# Altium schematic sheet UVB LED Controller - current balancing.SchDoc: UVB LED Current Balancing
size A3; Author: Peake J; CompanyName: Scion Research; DrawnBy: Peake J; Engineer: Peake J; Organization: Scion; Address1: 49 Sala St; Address2: Whakarewarewa; Address3: Rotorua; Address4: New Zealand 3010; DocumentNumber: NA; Revision: 0; SheetNumber: 2; SheetTotal: 2
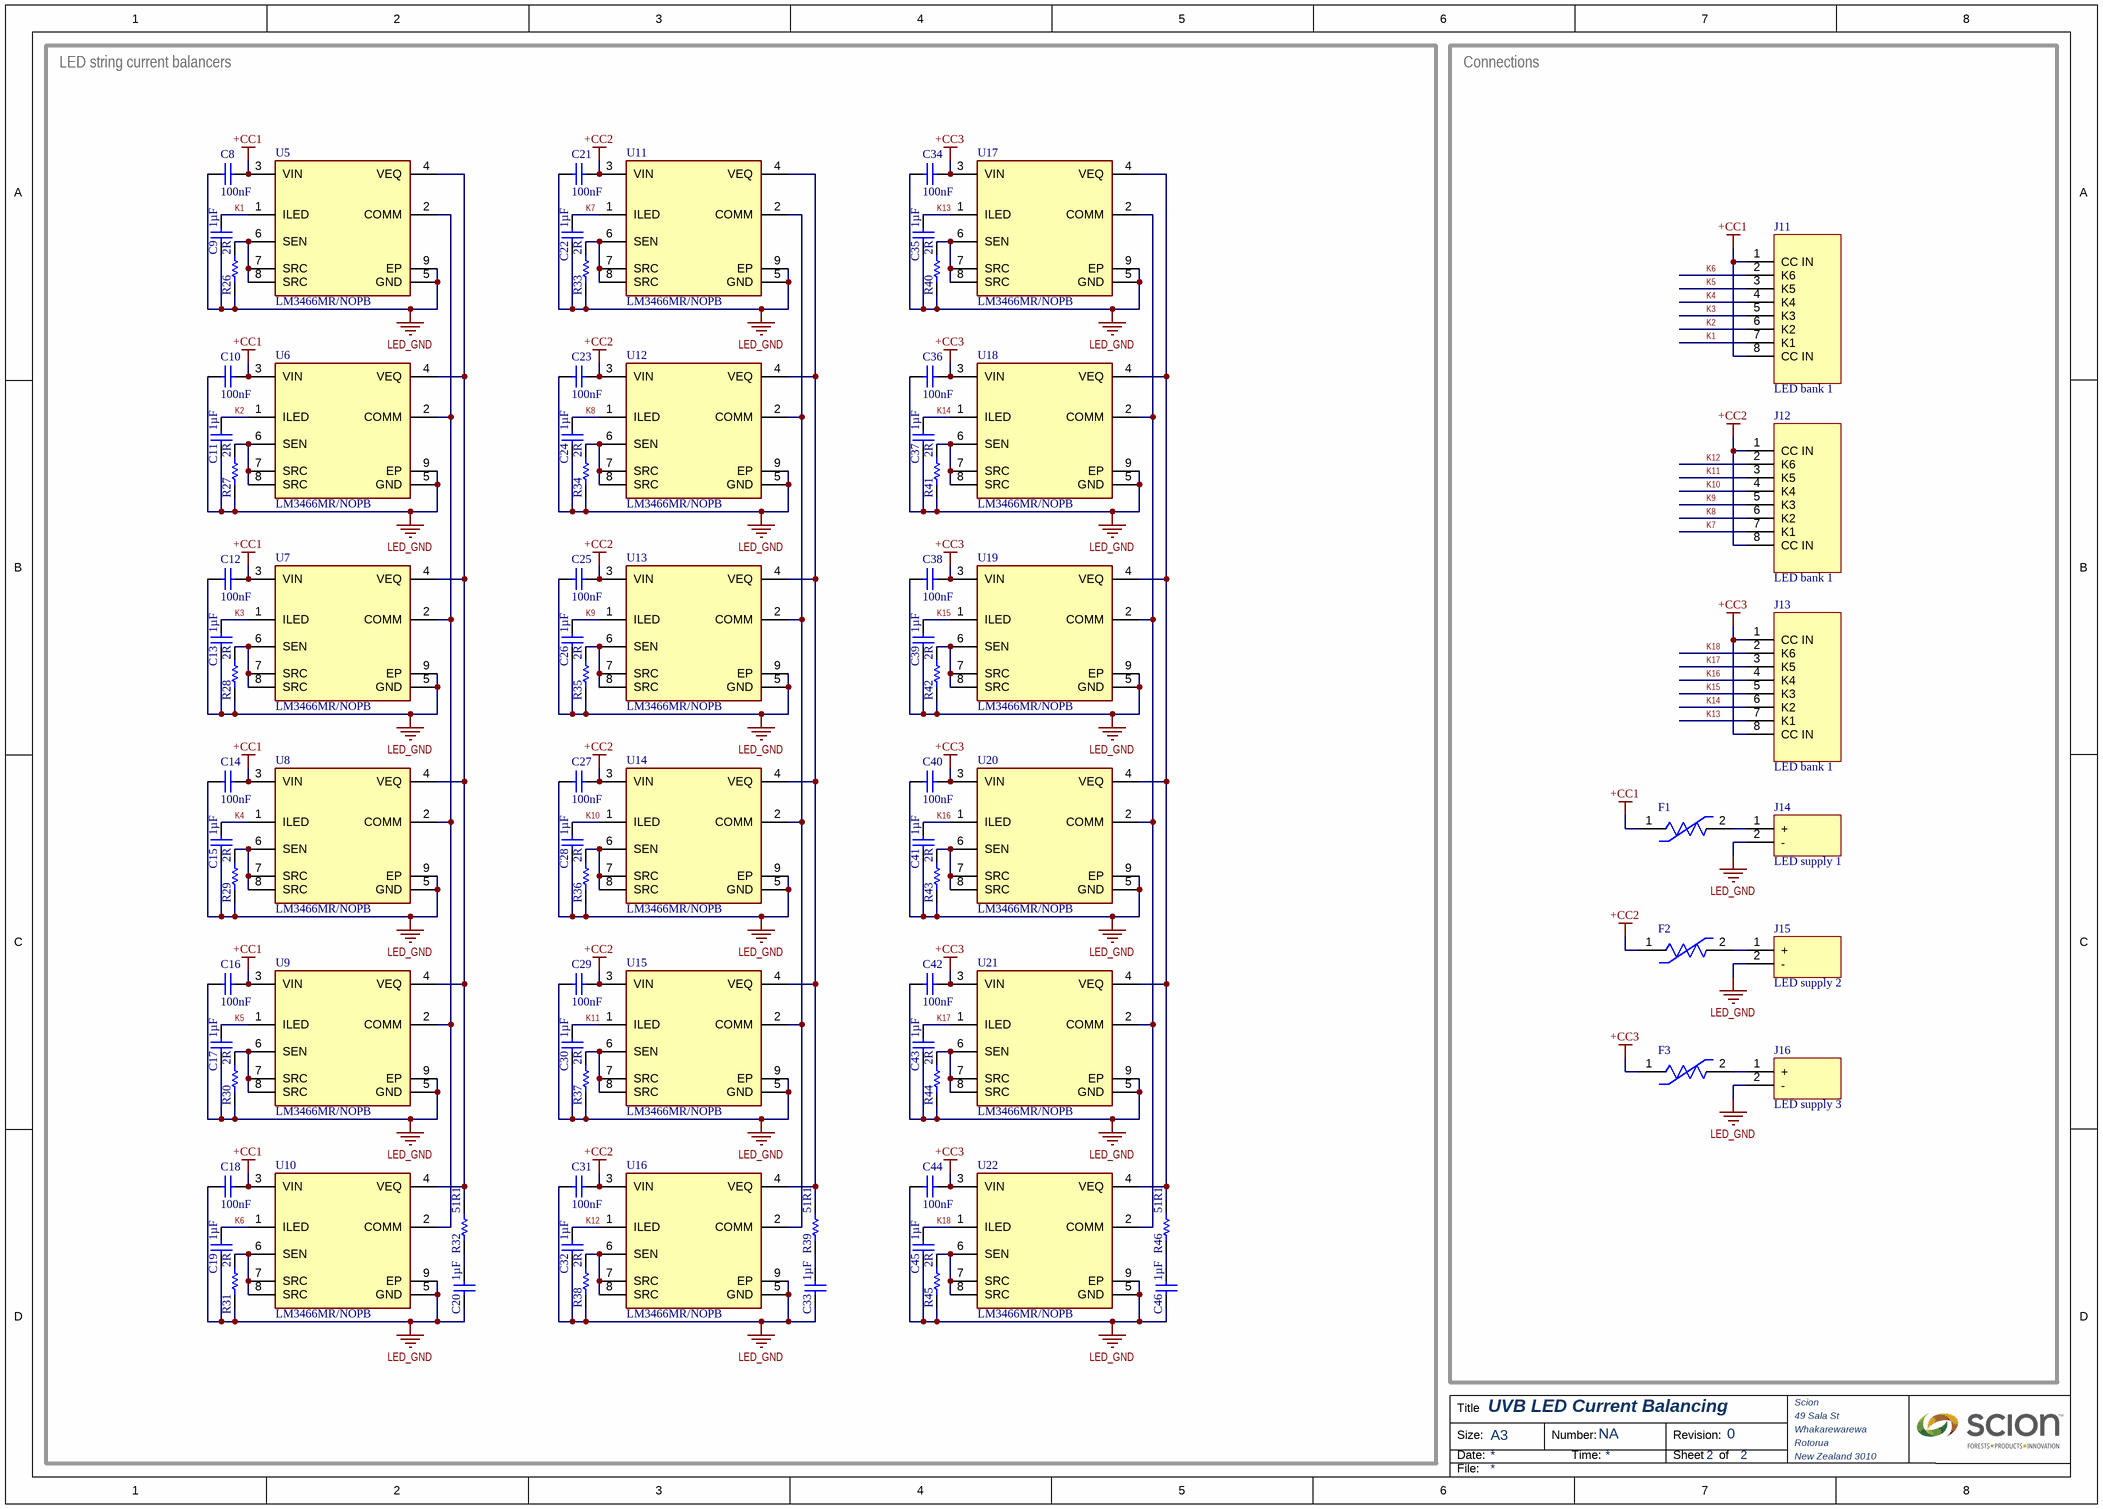
[diagram p0: UVB LED Controller - current balancing.SchDoc]

## Parts
C8  value 100nF  [0603_CAP]  (hidden comment: Capacitor)
C9  value 1µF  [0603_CAP]  (hidden comment: Capacitor)
C10  value 100nF  [0603_CAP]  (hidden comment: Capacitor)
C11  value 1µF  [0603_CAP]  (hidden comment: Capacitor)
C12  value 100nF  [0603_CAP]  (hidden comment: Capacitor)
C13  value 1µF  [0603_CAP]  (hidden comment: Capacitor)
C14  value 100nF  [0603_CAP]  (hidden comment: Capacitor)
C15  value 1µF  [0603_CAP]  (hidden comment: Capacitor)
C16  value 100nF  [0603_CAP]  (hidden comment: Capacitor)
C17  value 1µF  [0603_CAP]  (hidden comment: Capacitor)
C18  value 100nF  [0603_CAP]  (hidden comment: Capacitor)
C19  value 1µF  [0603_CAP]  (hidden comment: Capacitor)
C20  value 1µF  [0603_CAP]  (hidden comment: Capacitor)
C21  value 100nF  [0603_CAP]  (hidden comment: Capacitor)
C22  value 1µF  [0603_CAP]  (hidden comment: Capacitor)
C23  value 100nF  [0603_CAP]  (hidden comment: Capacitor)
C24  value 1µF  [0603_CAP]  (hidden comment: Capacitor)
C25  value 100nF  [0603_CAP]  (hidden comment: Capacitor)
C26  value 1µF  [0603_CAP]  (hidden comment: Capacitor)
C27  value 100nF  [0603_CAP]  (hidden comment: Capacitor)
C28  value 1µF  [0603_CAP]  (hidden comment: Capacitor)
C29  value 100nF  [0603_CAP]  (hidden comment: Capacitor)
C30  value 1µF  [0603_CAP]  (hidden comment: Capacitor)
C31  value 100nF  [0603_CAP]  (hidden comment: Capacitor)
C32  value 1µF  [0603_CAP]  (hidden comment: Capacitor)
C33  value 1µF  [0603_CAP]  (hidden comment: Capacitor)
C34  value 100nF  [0603_CAP]  (hidden comment: Capacitor)
C35  value 1µF  [0603_CAP]  (hidden comment: Capacitor)
C36  value 100nF  [0603_CAP]  (hidden comment: Capacitor)
C37  value 1µF  [0603_CAP]  (hidden comment: Capacitor)
C38  value 100nF  [0603_CAP]  (hidden comment: Capacitor)
C39  value 1µF  [0603_CAP]  (hidden comment: Capacitor)
C40  value 100nF  [0603_CAP]  (hidden comment: Capacitor)
C41  value 1µF  [0603_CAP]  (hidden comment: Capacitor)
C42  value 100nF  [0603_CAP]  (hidden comment: Capacitor)
C43  value 1µF  [0603_CAP]  (hidden comment: Capacitor)
C44  value 100nF  [0603_CAP]  (hidden comment: Capacitor)
C45  value 1µF  [0603_CAP]  (hidden comment: Capacitor)
C46  value 1µF  [0603_CAP]  (hidden comment: Capacitor)
F1  0ZCF0100AF2A  [FP-0ZCF0100AF2A-MFG]  (value not drawn)
F2  0ZCF0100AF2A  [FP-0ZCF0100AF2A-MFG]  (value not drawn)
F3  0ZCF0100AF2A  [FP-0ZCF0100AF2A-MFG]  (value not drawn)
J11  LED bank 1  [8P RA MOLEX Clik-MATE 1.5mm]
J12  LED bank 1  [8P RA MOLEX Clik-MATE 1.5mm]
J13  LED bank 1  [8P RA MOLEX Clik-MATE 1.5mm]
J14  LED supply 1  [2P 3.81mm Header Plugable]
J15  LED supply 2  [2P 3.81mm Header Plugable]
J16  LED supply 3  [2P 3.81mm Header Plugable]
R26  value 2R  [0603_RES]  (hidden comment: Resistor)
R27  value 2R  [0603_RES]  (hidden comment: Resistor)
R28  value 2R  [0603_RES]  (hidden comment: Resistor)
R29  value 2R  [0603_RES]  (hidden comment: Resistor)
R30  value 2R  [0603_RES]  (hidden comment: Resistor)
R31  value 2R  [0603_RES]  (hidden comment: Resistor)
R32  value 51R1  [0603_RES]  (hidden comment: Resistor)
R33  value 2R  [0603_RES]  (hidden comment: Resistor)
R34  value 2R  [0603_RES]  (hidden comment: Resistor)
R35  value 2R  [0603_RES]  (hidden comment: Resistor)
R36  value 2R  [0603_RES]  (hidden comment: Resistor)
R37  value 2R  [0603_RES]  (hidden comment: Resistor)
R38  value 2R  [0603_RES]  (hidden comment: Resistor)
R39  value 51R1  [0603_RES]  (hidden comment: Resistor)
R40  value 2R  [0603_RES]  (hidden comment: Resistor)
R41  value 2R  [0603_RES]  (hidden comment: Resistor)
R42  value 2R  [0603_RES]  (hidden comment: Resistor)
R43  value 2R  [0603_RES]  (hidden comment: Resistor)
R44  value 2R  [0603_RES]  (hidden comment: Resistor)
R45  value 2R  [0603_RES]  (hidden comment: Resistor)
R46  value 51R1  [0603_RES]  (hidden comment: Resistor)
U5  LM3466MR/NOPB  [FP-DDA0008A-MFG]
U6  LM3466MR/NOPB  [FP-DDA0008A-MFG]
U7  LM3466MR/NOPB  [FP-DDA0008A-MFG]
U8  LM3466MR/NOPB  [FP-DDA0008A-MFG]
U9  LM3466MR/NOPB  [FP-DDA0008A-MFG]
U10  LM3466MR/NOPB  [FP-DDA0008A-MFG]
U11  LM3466MR/NOPB  [FP-DDA0008A-MFG]
U12  LM3466MR/NOPB  [FP-DDA0008A-MFG]
U13  LM3466MR/NOPB  [FP-DDA0008A-MFG]
U14  LM3466MR/NOPB  [FP-DDA0008A-MFG]
U15  LM3466MR/NOPB  [FP-DDA0008A-MFG]
U16  LM3466MR/NOPB  [FP-DDA0008A-MFG]
U17  LM3466MR/NOPB  [FP-DDA0008A-MFG]
U18  LM3466MR/NOPB  [FP-DDA0008A-MFG]
U19  LM3466MR/NOPB  [FP-DDA0008A-MFG]
U20  LM3466MR/NOPB  [FP-DDA0008A-MFG]
U21  LM3466MR/NOPB  [FP-DDA0008A-MFG]
U22  LM3466MR/NOPB  [FP-DDA0008A-MFG]

## Blocks framed on the sheet
LED string current balancers: C8-C46 R26-R46 U5-U22
Connections: F1-F3 J11-J16

## Nets
+CC1: C8.1 C10.1 C12.1 C14.1 C16.1 C18.1 F1.1 J11.1(CC_IN) J11.8(CC_IN) U5.3(VIN) U6.3(VIN) U7.3(VIN) U8.3(VIN) U9.3(VIN) U10.3(VIN)
+CC2: C21.1 C23.1 C25.1 C27.1 C29.1 C31.1 F2.1 J12.1(CC_IN) J12.8(CC_IN) U11.3(VIN) U12.3(VIN) U13.3(VIN) U14.3(VIN) U15.3(VIN) U16.3(VIN)
+CC3: C34.1 C36.1 C38.1 C40.1 C42.1 C44.1 F3.1 J13.1(CC_IN) J13.8(CC_IN) U17.3(VIN) U18.3(VIN) U19.3(VIN) U20.3(VIN) U21.3(VIN) U22.3(VIN)
LED_GND: C8.2 C9.2 C10.2 C11.2 C12.2 C13.2 C14.2 C15.2 C16.2 C17.2 C18.2 C19.2 C20.1 C21.2 C22.2 C23.2 C24.2 C25.2 C26.2 C27.2 C28.2 C29.2 C30.2 C31.2 C32.2 C33.1 C34.2 C35.2 C36.2 C37.2 C38.2 C39.2 C40.2 C41.2 C42.2 C43.2 C44.2 C45.2 C46.1 J14.2(-) J15.2(-) J16.2(-) R26.1 R27.1 R28.1 R29.1 R30.1 R31.1 R33.1 R34.1 R35.1 R36.1 R37.1 R38.1 R40.1 R41.1 R42.1 R43.1 R44.1 R45.1 U5.5(GND) U5.9(EP) U6.5(GND) U6.9(EP) U7.5(GND) U7.9(EP) U8.5(GND) U8.9(EP) U9.5(GND) U9.9(EP) U10.5(GND) U10.9(EP) U11.5(GND) U11.9(EP) U12.5(GND) U12.9(EP) U13.5(GND) U13.9(EP) U14.5(GND) U14.9(EP) U15.5(GND) U15.9(EP) U16.5(GND) U16.9(EP) U17.5(GND) U17.9(EP) U18.5(GND) U18.9(EP) U19.5(GND) U19.9(EP) U20.5(GND) U20.9(EP) U21.5(GND) U21.9(EP) U22.5(GND) U22.9(EP)
K1: C9.1 J11.7(K1) U5.1(ILED)
K2: C11.1 J11.6(K2) U6.1(ILED)
K3: C13.1 J11.5(K3) U7.1(ILED)
K4: C15.1 J11.4(K4) U8.1(ILED)
K5: C17.1 J11.3(K5) U9.1(ILED)
K6: C19.1 J11.2(K6) U10.1(ILED)
K7: C22.1 J12.7(K1) U11.1(ILED)
K8: C24.1 J12.6(K2) U12.1(ILED)
K9: C26.1 J12.5(K3) U13.1(ILED)
K10: C28.1 J12.4(K4) U14.1(ILED)
K11: C30.1 J12.3(K5) U15.1(ILED)
K12: C32.1 J12.2(K6) U16.1(ILED)
K13: C35.1 J13.7(K1) U17.1(ILED)
K14: C37.1 J13.6(K2) U18.1(ILED)
K15: C39.1 J13.5(K3) U19.1(ILED)
K16: C41.1 J13.4(K4) U20.1(ILED)
K17: C43.1 J13.3(K5) U21.1(ILED)
K18: C45.1 J13.2(K6) U22.1(ILED)
NetC20_2: C20.2 R32.1
NetC33_2: C33.2 R39.1
NetC46_2: C46.2 R46.1
NetF1_2: F1.2 J14.1(+)
NetF2_2: F2.2 J15.1(+)
NetF3_2: F3.2 J16.1(+)
NetR26_2: R26.2 U5.6(SEN) U5.7(SRC) U5.8(SRC)
NetR27_2: R27.2 U6.6(SEN) U6.7(SRC) U6.8(SRC)
NetR28_2: R28.2 U7.6(SEN) U7.7(SRC) U7.8(SRC)
NetR29_2: R29.2 U8.6(SEN) U8.7(SRC) U8.8(SRC)
NetR30_2: R30.2 U9.6(SEN) U9.7(SRC) U9.8(SRC)
NetR31_2: R31.2 U10.6(SEN) U10.7(SRC) U10.8(SRC)
NetR32_2: R32.2 U5.4(VEQ) U6.4(VEQ) U7.4(VEQ) U8.4(VEQ) U9.4(VEQ) U10.4(VEQ)
NetR33_2: R33.2 U11.6(SEN) U11.7(SRC) U11.8(SRC)
NetR34_2: R34.2 U12.6(SEN) U12.7(SRC) U12.8(SRC)
NetR35_2: R35.2 U13.6(SEN) U13.7(SRC) U13.8(SRC)
NetR36_2: R36.2 U14.6(SEN) U14.7(SRC) U14.8(SRC)
NetR37_2: R37.2 U15.6(SEN) U15.7(SRC) U15.8(SRC)
NetR38_2: R38.2 U16.6(SEN) U16.7(SRC) U16.8(SRC)
NetR39_2: R39.2 U11.4(VEQ) U12.4(VEQ) U13.4(VEQ) U14.4(VEQ) U15.4(VEQ) U16.4(VEQ)
NetR40_2: R40.2 U17.6(SEN) U17.7(SRC) U17.8(SRC)
NetR41_2: R41.2 U18.6(SEN) U18.7(SRC) U18.8(SRC)
NetR42_2: R42.2 U19.6(SEN) U19.7(SRC) U19.8(SRC)
NetR43_2: R43.2 U20.6(SEN) U20.7(SRC) U20.8(SRC)
NetR44_2: R44.2 U21.6(SEN) U21.7(SRC) U21.8(SRC)
NetR45_2: R45.2 U22.6(SEN) U22.7(SRC) U22.8(SRC)
NetR46_2: R46.2 U17.4(VEQ) U18.4(VEQ) U19.4(VEQ) U20.4(VEQ) U21.4(VEQ) U22.4(VEQ)
NetU5_2: U5.2(COMM) U6.2(COMM) U7.2(COMM) U8.2(COMM) U9.2(COMM) U10.2(COMM)
NetU11_2: U11.2(COMM) U12.2(COMM) U13.2(COMM) U14.2(COMM) U15.2(COMM) U16.2(COMM)
NetU17_2: U17.2(COMM) U18.2(COMM) U19.2(COMM) U20.2(COMM) U21.2(COMM) U22.2(COMM)

## Notes on the sheet
- Title
- Size:
- Date:
- A3
- Number:
- Time:
- Revision:
- Sheet
- of
- File:

## Library data of the parts
C8-C46 = CMP-001-00172-2: SMD Capacitor; Pins: 2; Source: Discrete.SchLib; Design Item ID: Capacitor; Component Type: Standard
F1-F3 = CMP-005-00014-2: PTC Resettable Fuse 100A 0.5s 60VDC 0.09 Ohm 2-Pin 2920 T/R; Time to Trip: 500ms; Hold Current: 1A; Trip Current: 2A; Pins: 2; Component Type: Standard; Thickness: 0.067inch; Width: 0.202inch; Series: 0ZCF; Max Operating Temperature: 85°C; Source: All Components - 30.06.23 - 18.27.SchLib; Min Operating Temperature: -40°C; Design Item ID: CMP-00051-1; Length: 0.29inch; Case/Package: 2920; RoHS Compliant: Yes; Packaging: Cut Tape; Max Current Rating: 100A; Case Code (Metric): 7351; Mount: Surface Mount
J11-J13 = CMP-002-00183-2: 8 Pin Connector; Pin Count: 8; Design Item ID: 8_Pin; Component Type: Standard; Pins: 8; Source: Connectors.SchLib
J14-J16 = CMP-002-00173-1: 2 Pin Connector; Design Item ID: 2_Pin; Pins: 2; Pin Count: 2; MFN: *; Component Type: Standard; Source: Connectors.SchLib
R26-R46 = CMP-009-00356-3: SMD Resistor; Pins: 2; Component Type: Standard; Design Item ID: Resistor; Source: Discrete.SchLib
U5-U22 = CMP-04914-000005-1: IC LED DRIVER LIN 1.5A 8SOPWRPAD; Manufacturer: Texas Instruments; Min Supply Voltage: 6V; Max Junction Temp: +125°C; Max Supply Voltage: 70V; Dimming: Analog; Standoff Height: 0mm; Number Of Outputs: 1; Nominal Supply Current: 550uA; Ipc Land Pattern Name: SOIC127P600X170-8; Output Current: 1.5A; Temperature Range Low: -40°C; Octopart: https://octopart.com/lm3466mr%2Fnopb-texas+instruments-24813886; Category: IC; ComponentLink2URL: http://www.ti.com/lit/ds/symlink/lm3466.pdf; Automotive: No; Device Class L2: Power Management ICs; Package: DDA0008A; Device Class L1: Integrated Circuits (ICs); Mouser Description: Multi-String LED Current Balancer for Use with Constant Current Power Supplies 8-SO PowerPAD -40 to 125; Output Voltage: 70V; Lead Free: Yes; Digikey Description: IC LED DRIVER LIN 1.5A 8SOPWRPAD; Temperature: -40°C to +125°C; Temperature Range High: +125°C; Height: 1.7mm; Device Class L3: LED Drivers; Manufacturer Part Number: LM3466MR/NOPB; RoHS: TRUE; ComponentLink2Description: Datasheet